# Altium schematic sheet MCUPower.SchDoc
size A4
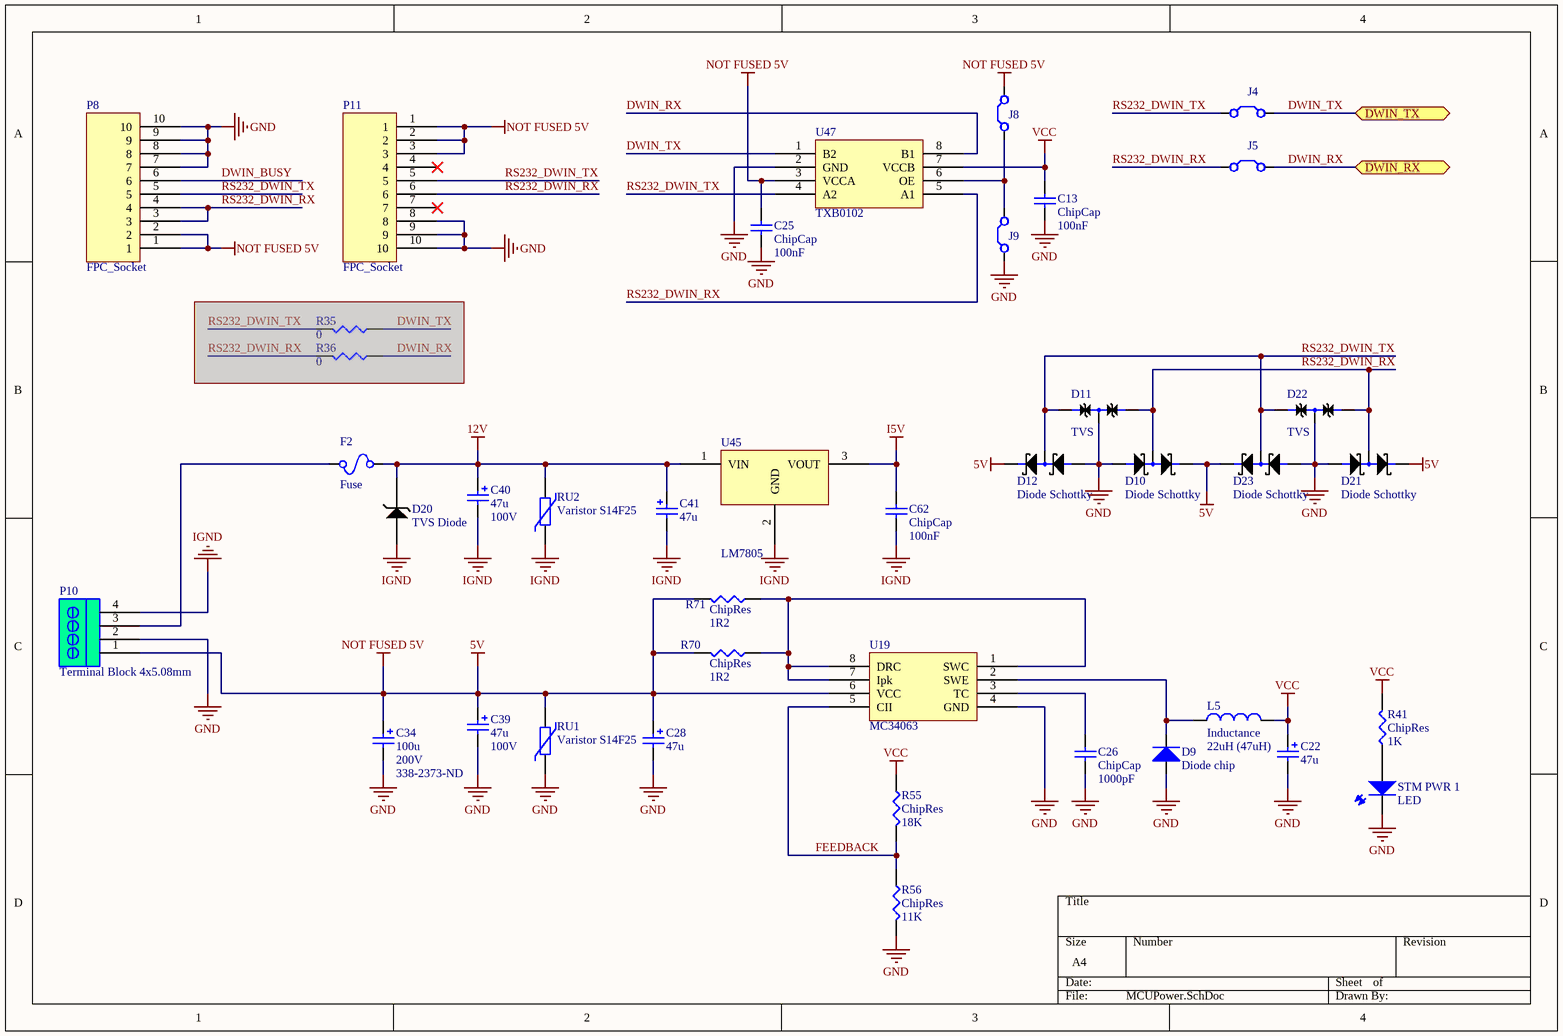
[diagram p0: MCUPower.SchDoc]

## Parts
C13  ChipCap  value 100nF  [CAP0805]
C22  value 47u  [CAPC7343]  (hidden comment: Cap Pol SMD)
C25  ChipCap  value 100nF  [CAP0805]
C26  ChipCap  value 1000pF  [CAP0805]
C28  value 47u  [CAPC7343]  (hidden comment: Cap Pol SMD)
C34  value 100u  Voltage: 200V  Supplier Part Number 1: 338-2373-ND  [CAPPR7.5-16x25_1]  (hidden comment: Cap Pol 200/100)
C39  value 47u  Voltage: 100V  [CAPPR5-10x17_1]  (hidden comment: Cap Pol 100/47)
C40  value 47u  Voltage: 100V  [CAPPR5-10x17_1]  (hidden comment: Cap Pol 100/47)
C41  value 47u  [CAPC7343]  (hidden comment: Cap Pol SMD)
C62  ChipCap  value 100nF  [CAP0805]
D9  Diode chip  [SMB1]
D10  Diode Schottky  [SOT23]
D11  TVS  [SOT23]
D12  Diode Schottky  [SOT23]
D20  TVS Diode  [DO-214AS]
D21  Diode Schottky  [SOT23]
D22  TVS  [SOT23]
D23  Diode Schottky  [SOT23]
F2  Fuse  [PTC1812]
J4  Jumper  [J0805]  (value not drawn)  (net tie, no BOM)
J5  Jumper  [J0805]  (value not drawn)  (net tie, no BOM)
J8  Jumper  [J0805]  (value not drawn)  (net tie, no BOM)
J9  Jumper  [J0805]  (value not drawn)  (net tie, no BOM)
L5  Inductance  value 22uH (47uH)  [IHPL-3232]
P8  FPC_Socket  [MOLEX Header 8 2mm Pitch]
P10  Terminal Block 4x5.08mm  [Socket 4x5.08]
P11  FPC_Socket  [Molex FPC/FFC 10pin]
R35  value 0  [RES0805]  (hidden comment: ChipRes)  (masked out: inside a compile mask, not in the netlist)
R36  value 0  [RES0805]  (hidden comment: ChipRes)  (masked out: inside a compile mask, not in the netlist)
R41  ChipRes  value 1K  [RES0805]
R55  ChipRes  value 18K  [RES0805]
R56  ChipRes  value 11K  [RES0805]
R70  ChipRes  value 1R2  [RES0805]
R71  ChipRes  value 1R2  [RES0805]
RU1  Varistor S14F25  [S14K25]
RU2  Varistor S14F25  [S14K25]
STM_PWR_1  LED  [PLCC-2]
U19  MC34063  [SOP8]
U45  LM7805  [TO-220]
U47  TXB0102  [SOIC8]

## Ports
DWIN_RX, DWIN_TX

## Nets
5V: C25.2 C28.1 C34.1 C39.1 D10.2 D12.2 D21.2 D23.2 J8.1 P8.1 P8.2 P10.1 P11.1 P11.2 P11.3 R70.2 R71.2 RU1.2 U19.6(VCC) U47.3(VCCA)  [also labelled NOT FUSED 5V]
12V: C40.1 C41.1 D20.1 F2.1 RU2.2 U45.1(VIN)
GND: C13.1 C22.2 C25.1 C26.1 C28.2 C34.2 C39.2 D9.1(A) D10.1 D11.3 D12.1 D21.1 D22.3 D23.1 J9.0 P8.7 P8.8 P8.9 P8.10 P10.2 P11.8 P11.9 P11.10 R56.2 RU1.1 STM_PWR_1.1 U19.4(GND) U47.2(GND)
I5V: C62.2 U45.3(VOUT)
IGND: C40.2 C41.2 C62.1 D20.2 P10.4 RU2.1 U45.2(GND)
VCC: C13.2 C22.1 L5.1 R41.2 R55.1 U47.7(VCCB)
DWIN_BUSY: P8.6
DWIN_RX: J5.1 U47.8(B1) ; port DWIN_RX
DWIN_TX: J4.1 U47.1(B2) ; port DWIN_TX
FEEDBACK: R55.2 R56.1 U19.5(CII)
RS232_DWIN_RX: D10.3 D11.2 D21.3 D22.2 J5.0 P8.3 P8.4 P11.6 U47.5(A1)
RS232_DWIN_TX: D11.1 D12.3 D22.1 D23.3 J4.0 P8.5 P11.5 U47.4(A2)
NetC26_2: C26.2 U19.3(TC)
NetD9_2: D9.2(K) L5.2 U19.2(SWE)
NetF2_2: F2.2 P10.3
NetJ8_0: J8.0 J9.1 U47.6(OE)
NetR41_1: R41.1 STM_PWR_1.2
NetR70_1: R70.1 R71.1 U19.1(SWC) U19.7(Ipk) U19.8(DRC)

Not connected (* = marked no-connect by the designer): P11 4* 7*

## Library data of the parts
C13 C25 C26 C62 = ChipCap: Capacitor; Published: 8-Jun-2000; LatestRevisionDate: 17-Jul-2002; LatestRevisionNote: Re-released for DXP Platform.; PackageReference: RAD-0.3; Publisher: Altium Limited
C22 C28 C41 = Cap Pol Chip: Polarized Capacitor (Radial); Supplier 1: Digi-Key; Supplier Part Number 1: 399-4029-1-ND
C34 = Cap Pol 200/100: Polarized Capacitor (Radial); Supplier 1: Digi-Key
C39 C40 = Cap Pol 100/47: Polarized Capacitor (Radial); Supplier 1: Digi-Key; Supplier Part Number 1: P1284-ND
D9 = Diode chip: Voltage: 1000V; Current (continuous): 3A; Current (peak, sine 8,3 ms): 150V; Junction capacitance: 50pF
D10 D12 D21 D23 = Schottky Diode: 2-Diode Schottky
D11 D22 = TVS Diode: Dual bidirectional voltage supresor
D20 = TVS Diode SMA
F2 = Fuse PTC1812: Fuse PTC 1812 Thermoresistor
L5 = ChipInductance
P10 = Socket_4x5.08_RA_2Wall: Terminal Block Socket Right Angle 4x5.08mm 2-Wall
R35 R36 R41 R55 R56 R70 R71 = ChipRes: Chip resistor
RU1 RU2 = Varistor S14K25: varistor
STM_PWR_1 = LED0603
U19 = MC34063: DC/DC converter control circuit; ComponentLink1Description: Datasheet; ComponentLink1URL: https://www.terraelectronica.ru/show_pdf.php?pdf=%2Fds%2Fpdf%2Fm%2Fmc34063acd-tr.pdf; HelpURL: MC34063; Supplier 1: Terraelectronica; Supplier Part Number 1: 356799; Supplier 2: Elgrad; Supplier Part Number 2: 30445; Supplier 3: Compel; Supplier Part Number 3: MC34063AG- S08-T(R)
U45 = LM7805: Linear voltage regulator 1A
U47 = TXB0102: 2-bit bidirectional voltage-level translator